# Altium schematic sheet Sheet1.SchDoc
size A4
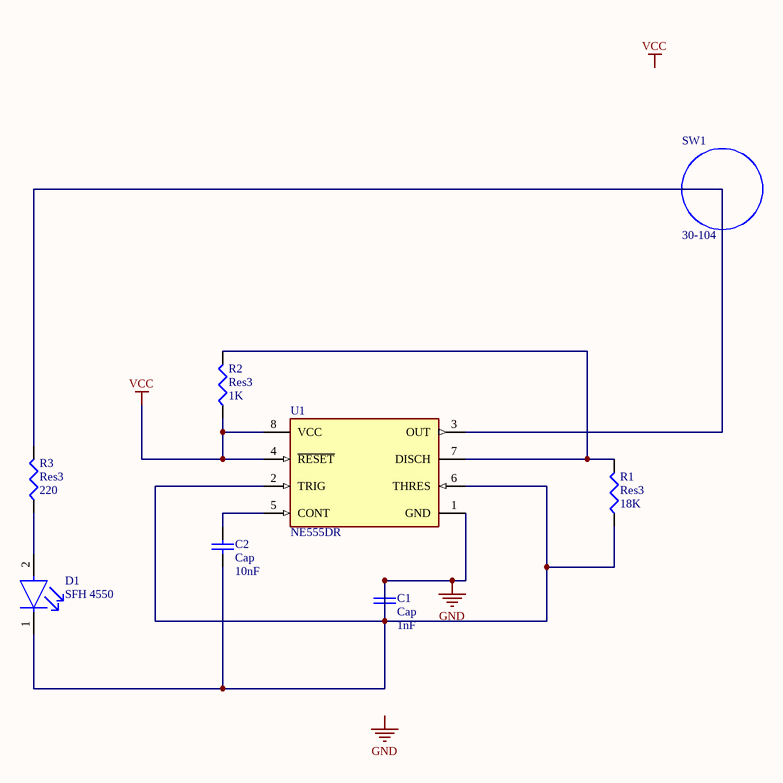
[diagram p0: Sheet1.SchDoc]

## Parts
C1  Cap  value 1nF  [RAD-0.3]
C2  Cap  value 10nF  [RAD-0.3]
D1  SFH 4550  [FP-SFH_4550-MFG]
R1  Res3  value 18K  [J1-0603]
R2  Res3  value 1K  [J1-0603]
R3  Res3  value 220  [J1-0603]
SW1  30-104  [FP-30-104-MFG]
U1  NE555DR  [FP-D0008A-IPC_A]

## Nets
GND: C1.1 C1.2 C2.1 D1.1(C) R1.1 U1.1(GND) U1.2(TRIG) U1.6(THRES)
VCC: R2.1 U1.4(~{RESET}) U1.8(VCC)
NetC2_2: C2.2 U1.5(CONT)
NetD1_2: D1.2(A) R3.1
NetR1_2: R1.2 R2.2 U1.7(DISCH)
NetR3_2: R3.2 U1.3(OUT)

## Notes on the sheet
- Labels drawn without touching a wire or pin: GND, VCC

## Library data of the parts
C1 C2 = Cap: Capacitor; Published: 8-Jun-2000; LatestRevisionDate: 17-Jul-2002; LatestRevisionNote: Re-released for DXP Platform.; PackageReference: RAD-0.3; Publisher: Altium Limited; PackageDescription: Radial Cap, Thru-Hole; 2 Leads; 0.3 in Pin Spacing
D1 = CMP-62016-000011-1: EMITTER IR 860NM 100MA RADIAL; Manufacturer: Osram Opto; Forward Voltage: 1.5V; Reverse Voltage: 5V; Viewing Angle: 6°; Led Orientation: Straight; Colour: Infrared; Mouser Description: Infrared Emitters - High Power Infrared 850 nm HALF ANGLE +/-3DEG; RoHS: TRUE; Manufacturer Part Number: SFH 4550; Forward Current: 100mA; Octopart: https://octopart.com/sfh+4550-osram+opto-55410894; ComponentLink2Description: Datasheet; Lead Free: Yes; Temperature: -40°C to +100°C; ComponentLink2URL: https://dammedia.osram.info/media/resource/hires/osram-dam-5580407/SFH%204550_EN.pdf; Device Class L2: LEDs; Temperature Range Low: -40°C; Digikey Description: EMITTER IR 860NM 100MA RADIAL; Temperature Range High: +100°C; Device Class L3: unset; Peak Emmision Wavelength: 860nm; Category: Diode; Package: SFH 4550; Device Class L1: Optoelectronics; Automotive: No
R1-R3 = Res3: Resistor; Published: 8-Jun-2000; LatestRevisionDate: 29-May-2009; LatestRevisionNote: IPC-7351 Footprint Added.; PackageReference: J1-0603; Publisher: Altium Limited; PackageDescription: Chip Resistor
SW1 = CMP-31944-000004-1: SWITCH PUSH SPST-NO 0.15A 24V; Current Rating: 150mA; Throw Configuration: SPST; Actuator Type: Round, Button; Mechanical Life: 500000Cycles; Contact Resistance: 25mR; Number of Poles: 1; Switch Function: Off-Mom; Actuator Length: 2.03mm; Actuator Material: Nylon; Insulation Resistance: 1.029GR; Approvals: UL; Illumination Color: Orange; Length: 17.53mm; Contact Voltage Rating (DC): 24V; Depth: 17.53mm; Housing Material: Nylon; Termination: Solder; Max Voltage Rating (DC): 24V; Voltage Rating: 24V; Diameter: 17.5mm; Contact Material: Brass; Radiation Hardening: No; Mount: Panel; Voltage Rating (DC): 24V; Contact Plating: Gold; Color: Orange; Max Operating Temperature: 80°C; Contact Current Rating: 150mA; Min Operating Temperature: -40°C; Max Current Rating: 150mA; Electrical Life: 500000Cycles; Orientation: Straight; Series: 30; RoHS Compliant: Yes; Packaging: Bulk; Actuator Color: Orange; Lead Free: Lead Free
U1 = CMP-1685-00007-2: IC OSC SGL TIMER 100KHZ 8-SOIC; Low Level Output Current: 200mA; Quiescent Current: 15mA; Min Supply Voltage: 4.5V; Number of Timers/Counters: 1; Max Supply Voltage: 16V; Operating Supply Current: 10mA; High Level Output Current: -200mA; Packaging: Tape and Reel; Frequency: 100kHz; Weight: 0.002561oz; REACH SVHC: No SVHC; Package Quantity: 2500; Width: 3.91mm; Max Operating Temperature: 70°C; Contact Plating: Gold; Lead Free: Lead Free; Number of Pins: 8; Min Operating Temperature: 0°C; Radiation Hardening: No; Length: 4.9mm; Case/Package: SOIC; Height: 1.58mm; Mount: Surface Mount